# EAGLE design Segnalino (EAGLE 7.2.0)
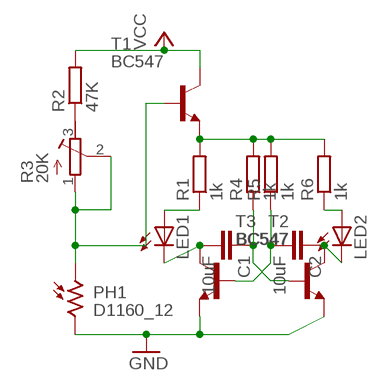
[diagram p0: schematic, sheet 1]

## Parts
C1  10uF  C-EU025-024X044  [C025-024X044]
C2  10uF  C-EU025-024X044  [C025-024X044]
LED1  LED3MM  [LED3MM]
LED2  LED3MM  [LED3MM]
PH1  D1160_12  [D11XX]
R1  1k  R-EU_0204/2V  [0204V]
R2  47K  R-EU_0204/2V  [0204V]
R3  20K  R-TRIMM3339P  [RTRIM3339P]
R4  1k  R-EU_0204/2V  [0204V]
R5  1k  R-EU_0204/2V  [0204V]
R6  1k  R-EU_0204/2V  [0204V]
T1  BC547  [TO92]
T2  BC547  [TO92]
T3  BC547  [TO92]

## Nets
GND: PH1.2 T2.1(E) T3.1(E)
N$1: C1.2 LED1.K(C) T2.3(C)
N$2: R2.1 R3.3(E)
N$3: C1.1 R4.1 T3.2(B)
N$4: PH1.1 R3.1(A) R3.2(S) T1.2(B)
N$5: R1.2 R4.2 R5.2 R6.2 T1.1(E)
N$7: C2.2 R5.1 T2.2(B)
N$8: LED1.A R1.1
N$9: LED2.A R6.1
N$10: C2.1 LED2.K(C) T3.3(C)
VCC: R2.2 T1.3(C)

## Library data of the parts
C1 C2 = rcl:C-EU: CAPACITOR, European symbol
LED1 LED2 = led:LED: LED OSRAM: - CHIPLED LG R971, LG N971, LY N971, LG Q971, LY Q971, LO R971, LY R971 LH N974, LH R974 LS Q976, LO Q976, LY Q976 LO Q996 - Hyper CHIPLED LW Q18S LB Q993, LB Q99A, LB R99A - SideLED LS A670, LO A670, LY A670, LG A670, LP A670 LB A673, LV A673, LT A673, LW A673 LH A674 LY A675 LS A676, LA A676, LO A676, LY A676, LW A676 LS A679, LY A679, LG A679 - Hyper Micro SIDELED® LS Y876, LA Y876, LO Y876, LY Y876 LT Y87S - SmartLED LW L88C, LW L88S LB L89C, LB L89S, LG L890 LS L89K, LO L89K, LY L89K LS L896, LA L896, LO L896, LY L896 - TOPLED LS T670, LO T670, LY T670, LG T670, LP T670 LSG T670, LSP T670, LSY T670, LOP T670, LYG T670 LG T671, LOG T671, LSG T671 LB T673, LV T673, LT T673, LW T673 LH T674 LS T676, LA T676, LO T676, LY T676, LB T676, LH T676, LSB T676, LW T676 LB T67C, LV T67C, LT T67C, LS T67K, LO T67K, LY T67K, LW E67C LS E67B, LA E67B, LO E67B, LY E67B, LB E67C, LV E67C, LT E67C LW T67C LS T679, LY T679, LG T679 LS T770, LO T770, LY T770, LG T770, LP T770 LB T773, LV T773, LT T773, LW T773 LH T774 LS E675, LA E675, LY E675, LS T675 LS T776, LA T776, LO T776, LY T776, LB T776 LHGB T686 LT T68C, LB T68C - Hyper Mini TOPLED® LB M676 - Mini TOPLED Santana® LG M470 LS M47K, LO M47K, LY M47K Source: http://www.osram.convergy.de LUXEON: - LUMILED® LXK2-PW12-R00, LXK2-PW12-S00, LXK2-PW14-U00, LXK2-PW14-V00 LXK2-PM12-R00, LXK2-PM12-S00, LXK2-PM14-U00 LXK2-PE12-Q00, LXK2-PE12-R00, LXK2-PE12-S00, LXK2-PE14-T00, LXK2-PE14-U00 LXK2-PB12-K00, LXK2-PB12-L00, LXK2-PB12-M00, LXK2-PB14-N00, LXK2-PB14-P00, LXK2-PB14-Q00 LXK2-PR12-L00, LXK2-PR12-M00, LXK2-PR14-Q00, LXK2-PR14-R00 LXK2-PD12-Q00, LXK2-PD12-R00, LXK2-PD12-S00 LXK2-PH12-R00, LXK2-PH12-S00 LXK2-PL12-P00, LXK2-PL12-Q00, LXK2-PL12-R00 Source: www.luxeon.com KINGBRIGHT: KA-3528ASYC Source: www.kingbright.com
PH1 = photo-elements:D11: Photo Sensor Oil Burner Control Applications Source: http://optoelectronics.perkinelmer.com/content/Datasheets/DTS_PhotocellsD1160.pdf
R1 R2 R4-R6 = rcl:R-EU_: RESISTOR, European symbol
R3 = resistor:R-TRIMM: Trimm resistor
T1-T3 = transistor:BC547: NPN TRANSISTOR

## Board
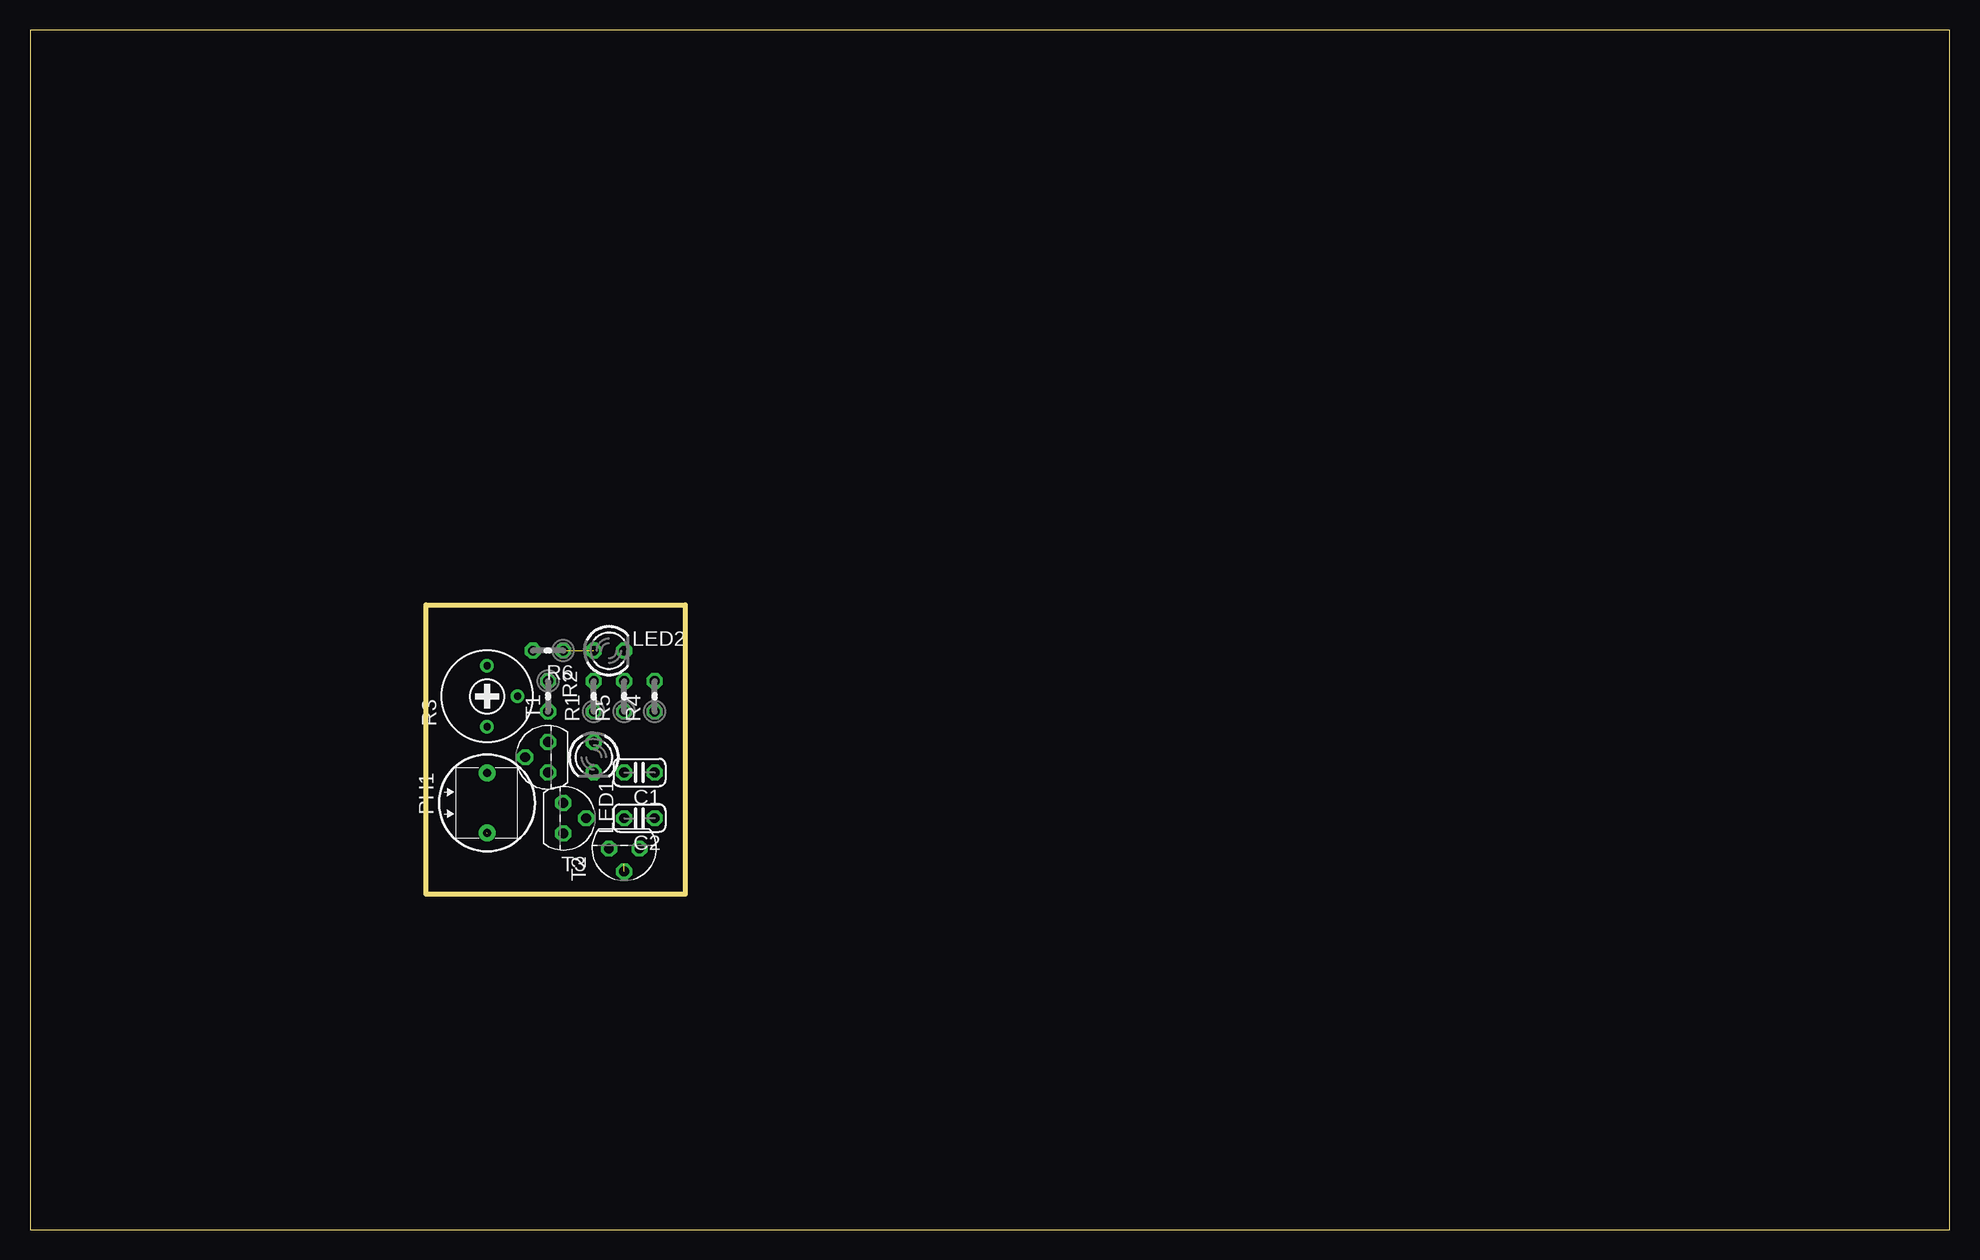
[diagram p1: board, top side]
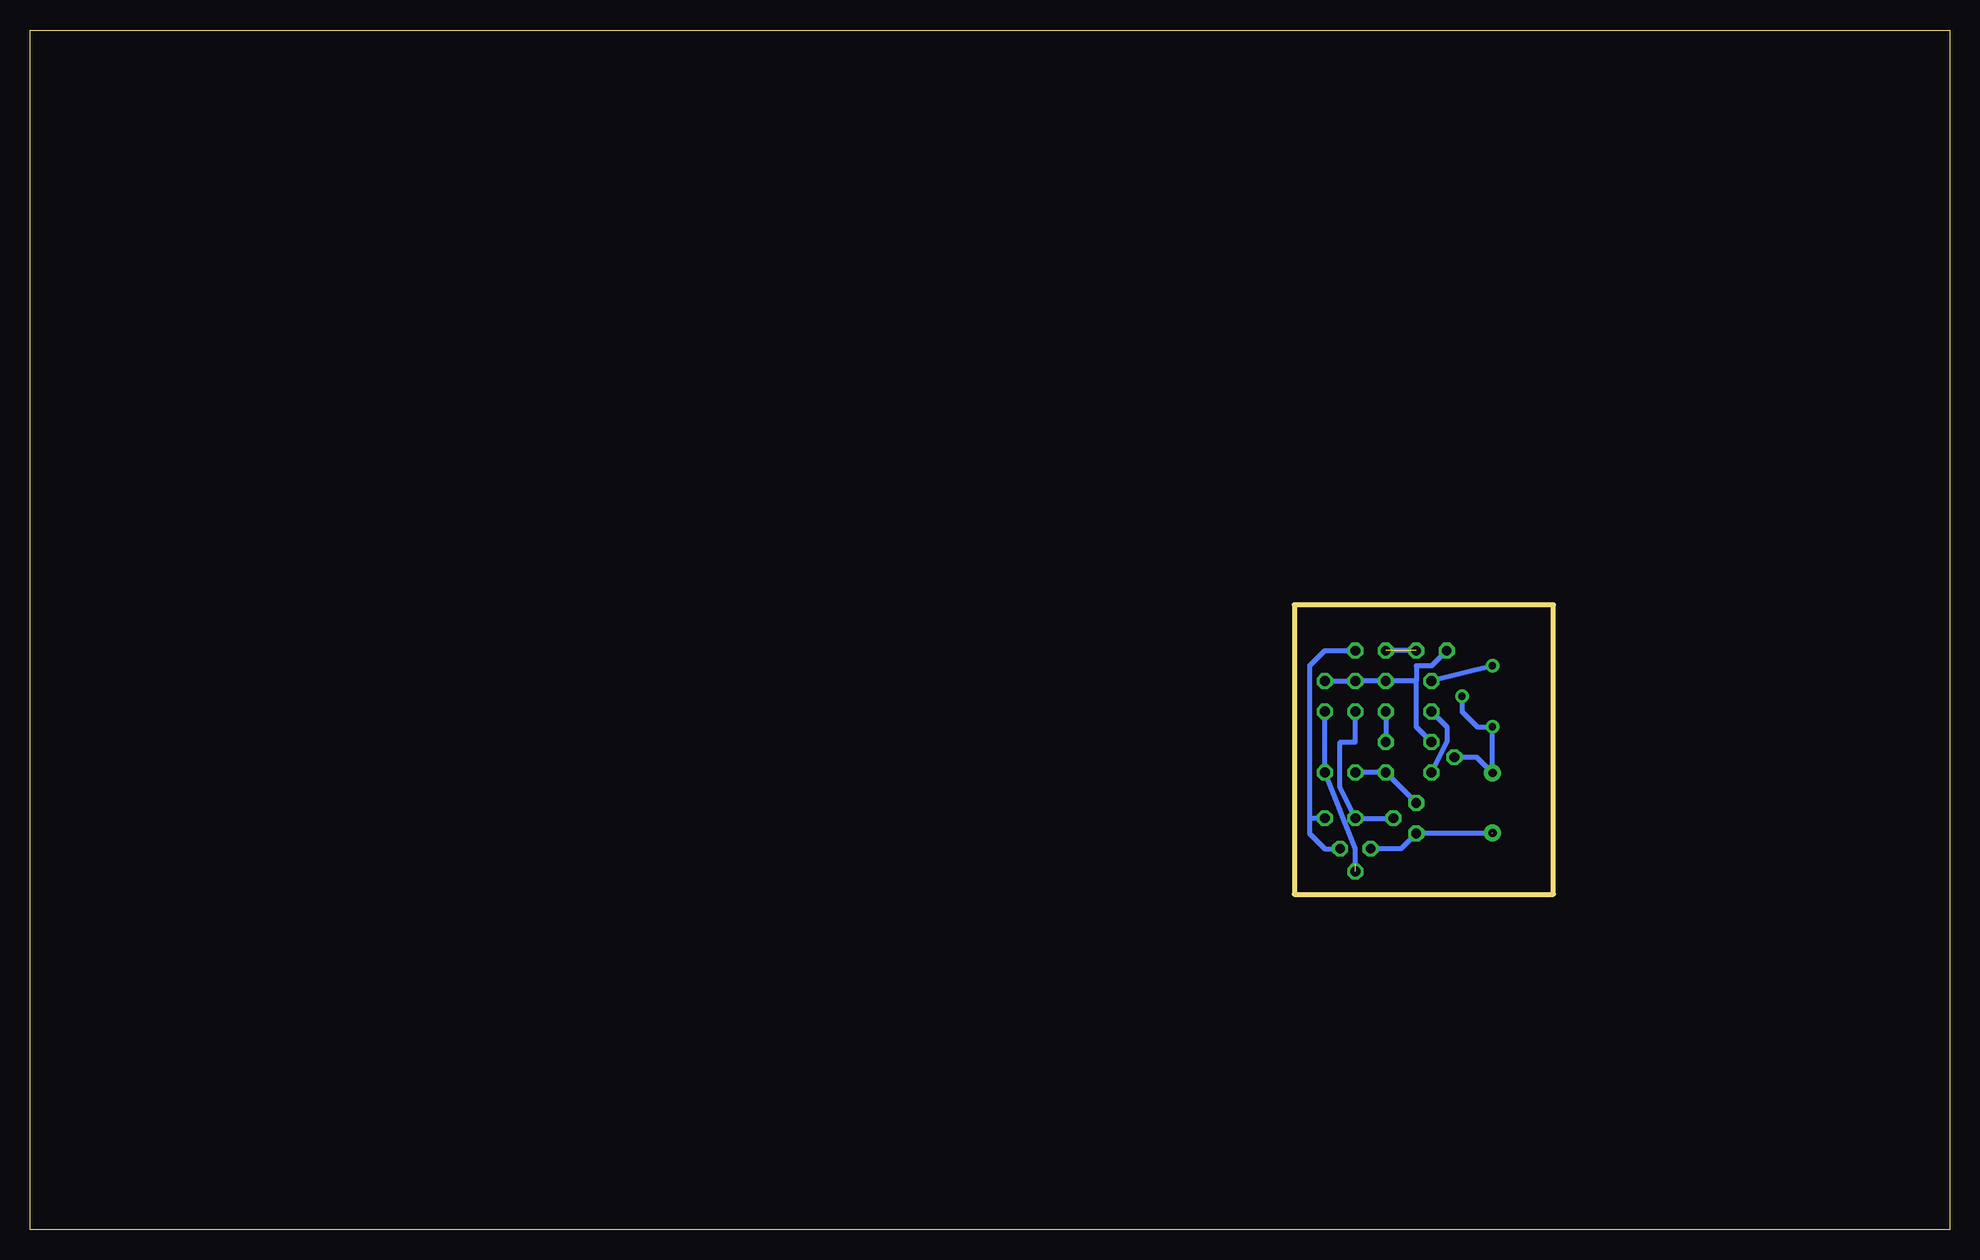
[diagram p2: board, bottom side, seen from below]

Size 160 x 100 mm. Coordinates in mm from the lower left corner, seen from the top.
Outline: 0,0 160,0 160,100 0,100 0,0
Outline: 54.61,52.07 54.61,27.94 33.02,27.94 33.02,52.07 54.61,52.07
Copper layers (1*16): Top 0.035mm / dielectric 1.5mm / Bottom 0.035mm
Design rules "default": minimum track width 10mil, minimum drill 24mil, track to track 8mil, track to pad 8mil, pad to pad 8mil, via to via 8mil, smd to smd 8mil, copper to edge 40mil, drill to drill 8mil, minimum pad ring 10mil, minimum via ring 8mil, stop-mask expansion 4mil, vias tented up to drill 0mil, thermal gap 10mil

### Footprints (pad centres in the part's own frame; a part is rotated, then mirrored left to right if it is on the bottom)
C025-024X044 = drill 0.813 octagon: 1 -1.27,0; 2 1.27,0
LED3MM = drill 0.813 octagon: A -1.27,0; K 1.27,0
D11XX = drill 0.7 pad 1.4: 1 -2.5,0; 2 2.5,0
0204V = drill 0.813 octagon: 1 -1.27,0; 2 1.27,0
RTRIM3339P = drill 0.61: 1 -2.54,0; 2 0,-2.54; 3 2.54,0
TO92 = drill 0.813 octagon: 1 1.27,0; 2 0,1.905; 3 -1.27,0

### Placement (x,y rotation side)
C1  50.8,38.1 180 top
C2  50.8,34.29 180 top
LED1  46.99,39.37 270 top
LED2  48.26,48.26 0 top
PH1  38.1,35.56 270 top
R1  46.99,44.45 90 top
R2  43.18,44.45 270 top
R3  38.1,44.45 90 top
R4  52.07,44.45 90 top
R5  49.53,44.45 90 top
R6  43.18,48.26 180 top
T1  43.18,39.37 90 top
T2  44.45,34.29 270 top
T3  49.53,31.75 180 top

### Tracks (layer width: path | path; a pad name or v marks a point on that pad's centre or on a via)
GND  (1 unrouted)
  Bottom 0.406: 38.1,33.02 T2.1 45.72,31.75 T3.1
N$1
  Bottom 0.406: T2.3 LED1.K C1.2
N$2
  Bottom 0.406: R3.3 R2.1
N$3  (1 unrouted)
  Bottom 0.406: 49.53,30.48 49.53,31.75 C1.1 R4.1
N$4
  Bottom 0.406: R3.2 40.64,43.18 39.37,41.91 R3.1 PH1.1 39.41,39.37 T1.2
N$5
  Bottom 0.406: T1.1 44.45,41.91 44.45,44.45 44.45,45.72 | 44.45,45.72 R1.2 R5.2 R4.2 | R6.2 43.18,46.99 44.45,46.99 44.45,45.72
N$7
  Bottom 0.406: T2.2 C2.2 50.8,36.83 50.8,40.64 49.53,40.64 R5.1
N$8
  Bottom 0.406: R1.1 LED1.A
N$9  (1 unrouted)
  Bottom 0.406: R6.1 LED2.A
N$10
  Bottom 0.406: C2.1 53.34,34.29 | LED2.K 52.07,48.26 53.34,46.99 53.34,34.29 | 53.34,34.29 53.34,33.02 52.07,31.75 T3.3
VCC
  Bottom 0.406: R2.2 41.91,41.91 41.91,40.64 T1.3